# EAGLE schematic spi-adapter (EAGLE 6.5.0)
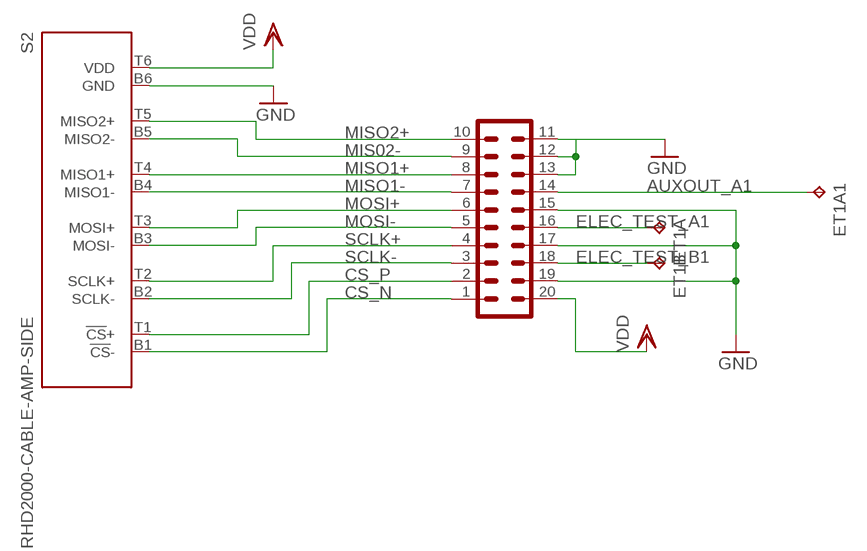
[diagram p0: schematic, sheet 1]

## Parts
ET1A  TPPAD1-13  [P1-13]
ET1A1  TPPAD1-13  [P1-13]
ET1B  TPPAD1-13  [P1-13]
HS1  JMD20-V  PINHD-2X10_JMD20-V  [JMD20-V]
S2  RHD2000-CABLE-AMP-SIDE  [OMNETICS_PZN-12-AA]

## Nets
AUXOUT_A1: ET1A1.TP HS1.14
CS_N: HS1.1 S2.B1(!CS!-)
CS_P: HS1.2 S2.T1(!CS!+)
ELEC_TEST_A1: ET1A.TP HS1.16
ELEC_TEST_B1: ET1B.TP HS1.18
GND: HS1.11 HS1.12 HS1.13 HS1.15 HS1.17 HS1.19 S2.B6(GND)
MIS02-: HS1.9 S2.B5(MISO2-)
MISO1+: HS1.8 S2.T4(MISO1+)
MISO1-: HS1.7 S2.B4(MISO1-)
MISO2+: HS1.10 S2.T5(MISO2+)
MOSI+: HS1.6 S2.T3(MOSI+)
MOSI-: HS1.5 S2.B3(MOSI-)
SCLK+: HS1.4 S2.T2(SCLK+)
SCLK-: HS1.3 S2.B2(SCLK-)
VDD: HS1.20 S2.T6(VDD)

## Library data of the parts
ET1A ET1A1 ET1B = testpad:TP: Test pad
HS1 = headstage:PINHD-2X10
S2 = RHD2000:RHD2000-CABLE-AMP-SIDE